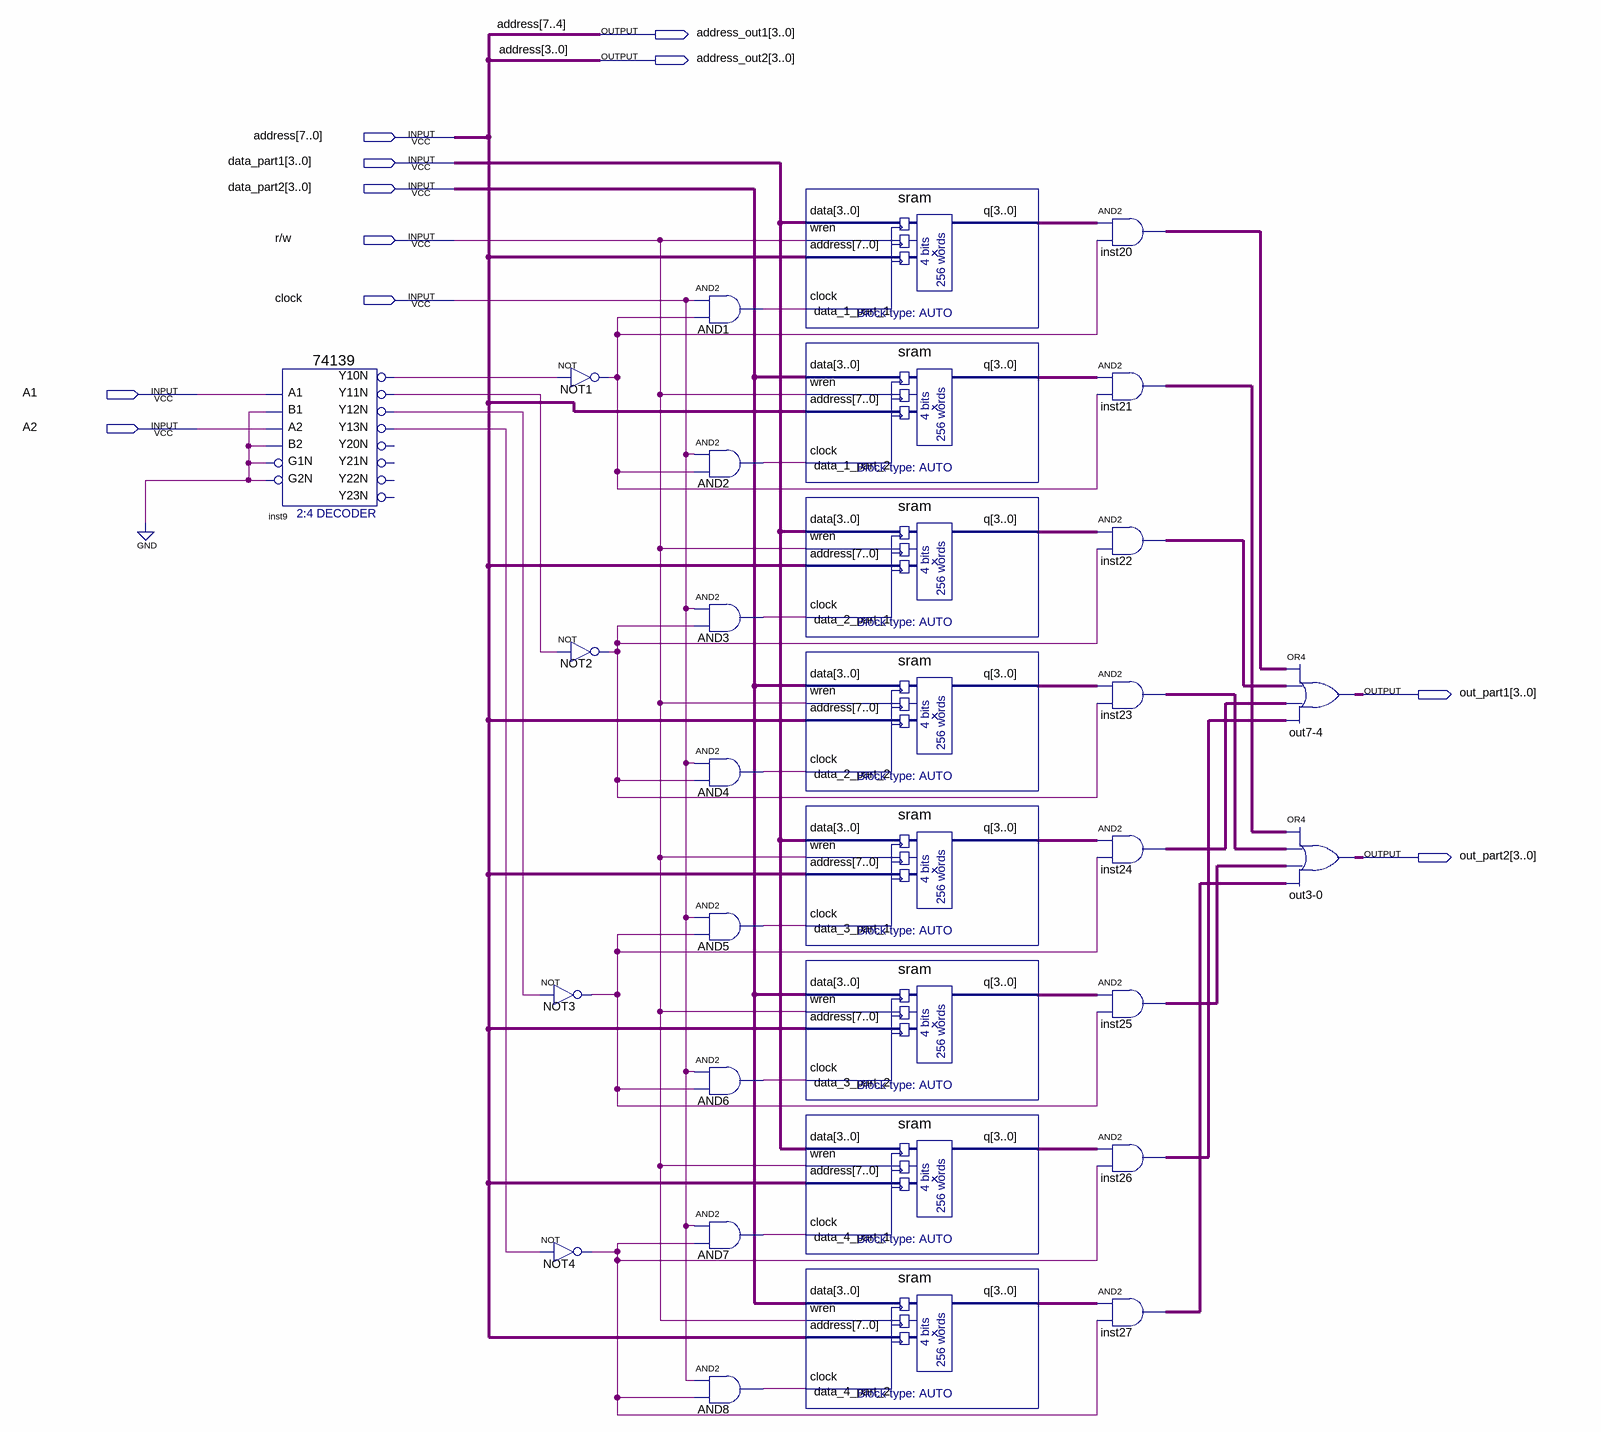
[diagram p0: schematic sheet]
// Quartus schematic experiment9.bdf as structural Verilog: 31 symbols, 11 pins
module experiment9 (
  input  [7:0] address,
  input  [3:0] data_part1,
  input  [3:0] data_part2,
  input  \r/w ,
  input  clock,
  input  A1,
  input  A2,
  output [3:0] address_out1,
  output [3:0] address_out2,
  output [3:0] out_part1,
  output [3:0] out_part2
);

  wire AND1_out, AND2_out, AND3_out, AND4_out, AND5_out, AND6_out, AND7_out, AND8_out, inst9_y10n,
       inst9_y11n, inst9_y12n, inst9_y13n, NOT1_out, NOT2_out, NOT3_out, NOT4_out;
  wire [3:0] data_1_part_1_q, data_1_part_2_q, data_2_part_1_q, data_2_part_2_q, data_3_part_1_q,
       data_3_part_2_q, data_4_part_1_q, data_4_part_2_q, inst20_out, inst21_out, inst22_out, inst23_out,
       inst24_out, inst25_out, inst26_out, inst27_out;

  \74139  inst9 (
    .A1(A1), .A2(A2), .B1(1'b0), .B2(1'b0), .G1N(1'b0), .G2N(1'b0), .Y10N(inst9_y10n), .Y13N(inst9_y13n),
    .Y12N(inst9_y12n), .Y11N(inst9_y11n));  // open: Y20N, Y21N, Y22N, Y23N
  not NOT3 (NOT3_out, inst9_y12n);
  not NOT4 (NOT4_out, inst9_y13n);
  not NOT1 (NOT1_out, inst9_y10n);
  not NOT2 (NOT2_out, inst9_y11n);
  and AND1 (AND1_out, clock, NOT1_out);
  and AND2 (AND2_out, clock, NOT1_out);
  and AND3 (AND3_out, clock, NOT2_out);
  and AND4 (AND4_out, clock, NOT2_out);
  and AND5 (AND5_out, clock, NOT3_out);
  and AND6 (AND6_out, clock, NOT3_out);
  and AND7 (AND7_out, clock, NOT4_out);
  and AND8 (AND8_out, clock, NOT4_out);
  sram data_1_part_1 (.data(data_part1), .wren(\r/w ), .address(address), .clock(AND1_out), .q(data_1_part_1_q));
  sram data_1_part_2 (.data(data_part2), .wren(\r/w ), .address(address), .clock(AND2_out), .q(data_1_part_2_q));
  sram data_2_part_1 (.data(data_part1), .wren(\r/w ), .address(address), .clock(AND3_out), .q(data_2_part_1_q));
  sram data_2_part_2 (.data(data_part2), .wren(\r/w ), .address(address), .clock(AND4_out), .q(data_2_part_2_q));
  sram data_3_part_1 (.data(data_part1), .wren(\r/w ), .address(address), .clock(AND5_out), .q(data_3_part_1_q));
  sram data_3_part_2 (.data(data_part2), .wren(\r/w ), .address(address), .clock(AND6_out), .q(data_3_part_2_q));
  sram data_4_part_1 (.data(data_part1), .wren(\r/w ), .address(address), .clock(AND7_out), .q(data_4_part_1_q));
  sram data_4_part_2 (.data(data_part2), .wren(\r/w ), .address(address), .clock(AND8_out), .q(data_4_part_2_q));
  assign inst20_out = data_1_part_1_q & {4{NOT1_out}};  // AND2 inst20, 4 bits wide
  assign inst21_out = data_1_part_2_q & {4{NOT1_out}};  // AND2 inst21, 4 bits wide
  assign inst22_out = data_2_part_1_q & {4{NOT2_out}};  // AND2 inst22, 4 bits wide
  assign inst23_out = data_2_part_2_q & {4{NOT2_out}};  // AND2 inst23, 4 bits wide
  assign inst24_out = data_3_part_1_q & {4{NOT3_out}};  // AND2 inst24, 4 bits wide
  assign inst25_out = data_3_part_2_q & {4{NOT3_out}};  // AND2 inst25, 4 bits wide
  assign inst26_out = data_4_part_1_q & {4{NOT4_out}};  // AND2 inst26, 4 bits wide
  assign inst27_out = data_4_part_2_q & {4{NOT4_out}};  // AND2 inst27, 4 bits wide
  assign out_part1 = inst20_out | inst22_out | inst24_out | inst26_out;  // OR4 out7-4, 4 bits wide
  assign out_part2 = inst21_out | inst23_out | inst25_out | inst27_out;  // OR4 out3-0, 4 bits wide

  assign address_out1 = address[7:4];
  assign address_out2 = address[3:0];
endmodule
